# EAGLE design hgc (EAGLE 9.5.2)
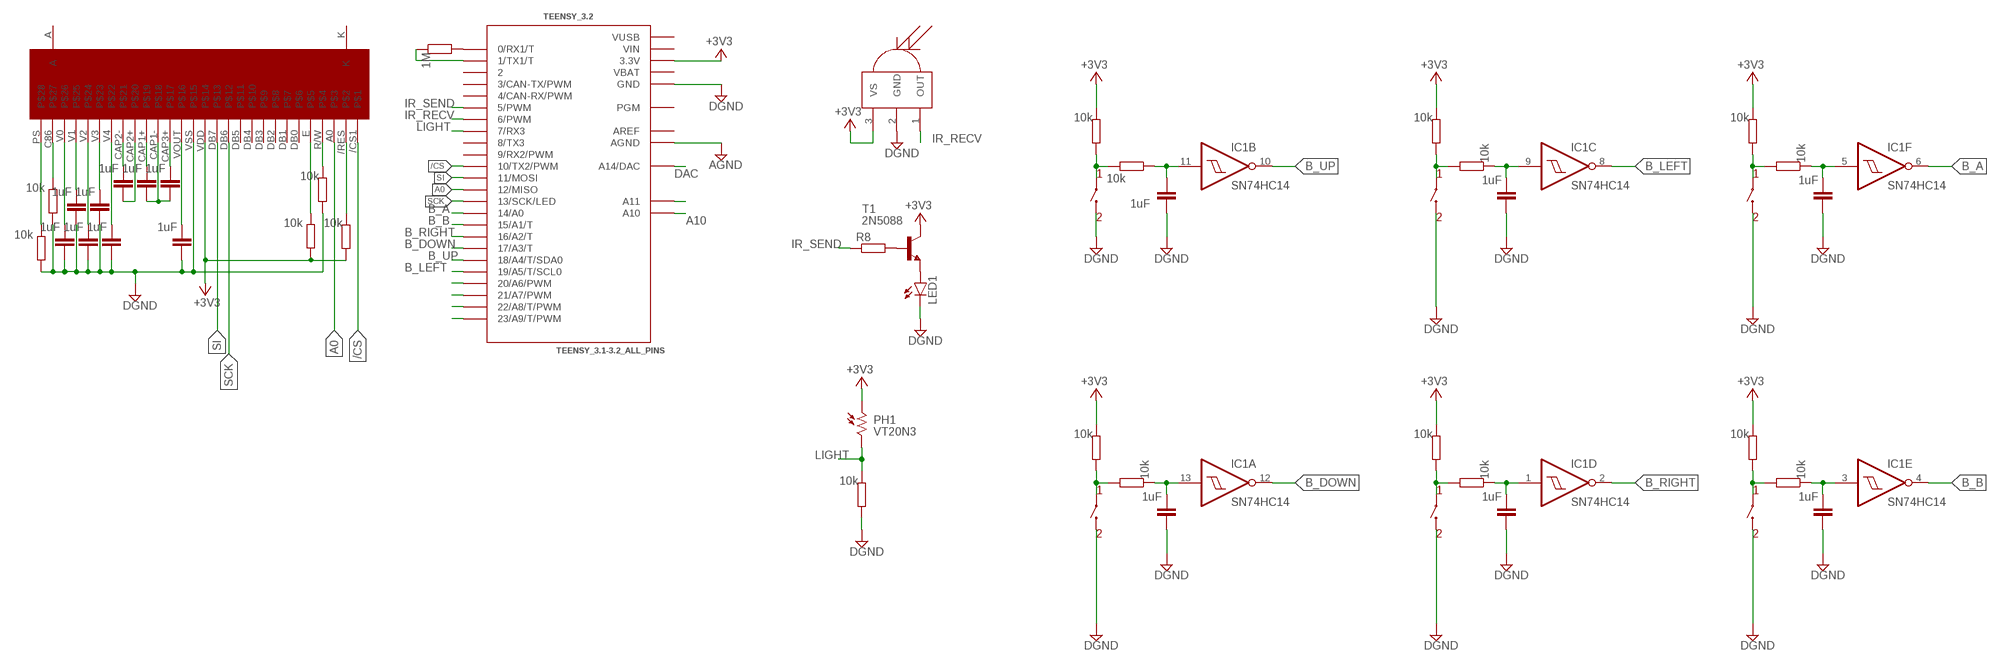
[diagram p0: schematic, sheet 1]

## Parts
A  TACTILE_SWITCH  [SPST-NO]
B  TACTILE_SWITCH  [SPST-NO]
C1  1uF  C-EUC0603  [C0603]
C2  1uF  C-EUC0603  [C0603]
C3  1uF  C-EUC0603  [C0603]
C4  1uF  C-EUC0603  [C0603]
C5  1uF  C-EUC0603  [C0603]
C6  1uF  C-EUC0603  [C0603]
C7  1uF  C-EUC0603  [C0603]
C8  1uF  C-EUC0603  [C0603]
C9  1uF  C-EUC0603  [C0603]
C10  1uF  C-EUC0603  [C0603]
C11  1uF  C-EUC0603  [C0603]
C12  1uF  C-EUC0603  [C0603]
C13  1uF  C-EUC0603  [C0603]
C14  1uF  C-EUC0603  [C0603]
C15  1uF  C-EUC0603  [C0603]
DOWN  TACTILE_SWITCH  [SPST-NO]
IC1  SN74HC14  74AC14D  [SO14]
LED1  LED3MM  [LED3MM]
LEFT  TACTILE_SWITCH  [SPST-NO]
PH1  VT20N3  [TO46-VT200]
R1  10k  R-EU_R0603  [R0603]
R2  10k  R-EU_R0603  [R0603]
R3  10k  R-EU_R0603  [R0603]
R4  10k  R-EU_R0603  [R0603]
R5  10k  R-EU_R0603  [R0603]
R6  10k  R-EU_R0603  [R0603]
R7  10k  R-EU_R0603  [R0603]
R8  R-EU_0204/7  [0204/7]
R9  10k  R-EU_R0603  [R0603]
R10  10k  R-EU_R0603  [R0603]
R11  10k  R-EU_R0603  [R0603]
R12  10k  R-EU_R0603  [R0603]
R13  10k  R-EU_R0603  [R0603]
R14  1M  R-EU_R0603  [R0603]
R15  10k  R-EU_R0603  [R0603]
R16  10k  R-EU_R0603  [R0603]
R18  10k  R-EU_R0603  [R0603]
R19  10k  R-EU_R0603  [R0603]
R21  10k  R-EU_R0603  [R0603]
R22  10k  R-EU_R0603  [R0603]
RIGHT  TACTILE_SWITCH  [SPST-NO]
T1  2N5088  [TO92]
TEENSY_3.2  TEENSY_3.1-3.2_ALL_PINS  [TEENSY_3.0-3.2&LC_ALL_PINS]
U$2  LCD_DISPLAY  [LCD_SCREEN]
U$3  IR_RECEIVER  [T-30_V]
UP  TACTILE_SWITCH  [SPST-NO]

## Nets
20: TEENSY_3.2.20/A6(20/A6/PWM)
21: TEENSY_3.2.21/A7(21/A7/PWM)
22: TEENSY_3.2.22/A8(22/A8/T/PWM)
23: TEENSY_3.2.23/A9(23/A9/T/PWM)
/CS: TEENSY_3.2.10(10/TX2/PWM) U$2./CS1
/WRITE: R2.1 U$2.R/W
A0: TEENSY_3.2.12(12/MISO) U$2.A0
A10: TEENSY_3.2.A10
A11: TEENSY_3.2.A11
AGND: TEENSY_3.2.AGND
B_A: IC1.6(F:O) TEENSY_3.2.14/A0
B_B: IC1.4(E:O) TEENSY_3.2.15/A1(15/A1/T)
B_DOWN: IC1.12(A:O) TEENSY_3.2.17/A3(17/A3/T)
B_LEFT: IC1.8(C:O) TEENSY_3.2.19/A5(19/A5/T/SCL0)
B_RIGHT: IC1.2(D:O) TEENSY_3.2.16/A2(16/A2/T)
B_UP: IC1.10(B:O) TEENSY_3.2.18/A4(18/A4/T/SDA0)
DAC: TEENSY_3.2.RESET/DAC(A14/DAC)
DGND: A.3 A.4 B.3 B.4 C1.2 C2.2 C3.2 C4.2 C5.2 C9.2 C10.2 C11.2 C12.2 C13.2 C14.2 C15.2 DOWN.3 DOWN.4 LED1.K(C) LEFT.3 LEFT.4 R2.2 R4.1 R5.1 R11.2 RIGHT.3 RIGHT.4 TEENSY_3.2.GND TEENSY_3.2.GND1(GND) U$2.VSS U$3.2(GND) UP.3 UP.4
ENABLE: R1.2 U$2.E
IR_RECV: TEENSY_3.2.6(6/PWM) U$3.1(OUT)
IR_SEND: R8.1 TEENSY_3.2.5(5/PWM)
LIGHT: PH1.2 R11.1 TEENSY_3.2.7(7/RX3)
N$1: C1.1 U$2.V0
N$2: C2.1 U$2.V1
N$3: C3.1 U$2.V2
N$4: C4.1 U$2.V3
N$5: C5.1 U$2.V4
N$6: C6.1 U$2.CAP2-
N$7: C7.1 U$2.CAP1+
N$8: C8.1 U$2.CAP3+
N$9: C9.1 U$2.VOUT
N$10: R3.1 U$2./RES
N$11: C6.2 U$2.CAP2+
N$12: C7.2 C8.2 U$2.CAP1-
N$13: R4.2 U$2.PS
N$14: R5.2 U$2.C86
N$15: LED1.A T1.3(E)
N$16: R6.2 R7.2 UP.1 UP.2
N$17: C10.1 IC1.11(B:I) R7.1
N$18: LEFT.1 LEFT.2 R9.2 R10.2
N$19: R8.2 T1.2(B)
N$20: C11.1 IC1.9(C:I) R10.1
N$21: A.1 A.2 R12.2 R13.2
N$23: C12.1 IC1.5(F:I) R13.1
N$24: DOWN.1 DOWN.2 R15.2 R16.2
N$25: R14.2 TEENSY_3.2.0(0/RX1/T)
N$26: C13.1 IC1.13(A:I) R16.1
N$27: R18.2 R19.2 RIGHT.1 RIGHT.2
N$28: R14.1 TEENSY_3.2.1(1/TX1/T)
N$29: C14.1 IC1.1(D:I) R19.1
N$30: B.1 B.2 R21.2 R22.2
N$32: C15.1 IC1.3(E:I) R22.1
SCK: TEENSY_3.2.13(13/SCK/LED) U$2.DB6
SI: TEENSY_3.2.11(11/MOSI) U$2.DB7
VCC: PH1.1 R1.1 R3.2 R6.1 R9.1 R12.1 R15.1 R18.1 R21.1 T1.1(C) TEENSY_3.2.3.3V TEENSY_3.2.3.3V1(3.3V) U$2.VDD U$3.3(VS) ; supply symbol labelled +3V3
Unconnected: TEENSY_3.2.2 TEENSY_3.2.3(3/CAN-TX/PWM) TEENSY_3.2.4(4/CAN-RX/PWM) TEENSY_3.2.8(8/TX3) TEENSY_3.2.9(9/RX2/PWM) TEENSY_3.2.PGM U$2.DB0 U$2.DB1 U$2.DB2 U$2.DB3 U$2.DB4 U$2.DB5

## Power pins joined to a net without a drawn wire
A: U$2.A
AREF: TEENSY_3.2.AREF
DGND: IC1.7(P:GND)
K: U$2.K
VBAT: TEENSY_3.2.VBAT
VCC: IC1.14(P:VCC)
VIN: TEENSY_3.2.VIN
VUSB: TEENSY_3.2.VUSB

## Library data of the parts
A B DOWN LEFT RIGHT UP = game_parts_library:TACTILE_SWITCH: A single pole single throw, normally open tactile switch. Manufacturer: C&K <https://www.ckswitches.com/> Manufacturer Part #: PTS526 SM15 SMTR2 LFS <https://dznh3ojzb2azq.cloudfront.net/products/Tactile/PTS526/documents/datasheet.pdf> Supplier: Digikey <https://www.digikey.com.au/> Supplier Part #: CKN12220-1-ND <https://www.digikey.com.au/short/zc3vrv>
C1-C15 = rcl:C-EU: CAPACITOR, European symbol; SPICEPREFIX: C
IC1 = 74xx-eu:74*14: Hex schmitt trigger INVERTER
LED1 = led:LED: LED OSRAM: - CHIPLED LG R971, LG N971, LY N971, LG Q971, LY Q971, LO R971, LY R971 LH N974, LH R974 LS Q976, LO Q976, LY Q976 LO Q996 - Hyper CHIPLED LW Q18S LB Q993, LB Q99A, LB R99A - SideLED LS A670, LO A670, LY A670, LG A670, LP A670 LB A673, LV A673, LT A673, LW A673 LH A674 LY A675 LS A676, LA A676, LO A676, LY A676, LW A676 LS A679, LY A679, LG A679 - Hyper Micro SIDELED® LS Y876, LA Y876, LO Y876, LY Y876 LT Y87S - SmartLED LW L88C, LW L88S LB L89C, LB L89S, LG L890 LS L89K, LO L89K, LY L89K LS L896, LA L896, LO L896, LY L896 - TOPLED LS T670, LO T670, LY T670, LG T670, LP T670 LSG T670, LSP T670, LSY T670, LOP T670, LYG T670 LG T671, LOG T671, LSG T671 LB T673, LV T673, LT T673, LW T673 LH T674 LS T676, LA T676, LO T676, LY T676, LB T676, LH T676, LSB T676, LW T676 LB T67C, LV T67C, LT T67C, LS T67K, LO T67K, LY T67K, LW E67C LS E67B, LA E67B, LO E67B, LY E67B, LB E67C, LV E67C, LT E67C LW T67C LS T679, LY T679, LG T679 LS T770, LO T770, LY T770, LG T770, LP T770 LB T773, LV T773, LT T773, LW T773 LH T774 LS E675, LA E675, LY E675, LS T675 LS T776, LA T776, LO T776, LY T776, LB T776 LHGB T686 LT T68C, LB T68C - Hyper Mini TOPLED® LB M676 - Mini TOPLED Santana® LG M470 LS M47K, LO M47K, LY M47K Source: http://www.osram.convergy.de LUXEON: - LUMILED® LXK2-PW12-R00, LXK2-PW12-S00, LXK2-PW14-U00, LXK2-PW14-V00 LXK2-PM12-R00, LXK2-PM12-S00, LXK2-PM14-U00 LXK2-PE12-Q00, LXK2-PE12-R00, LXK2-PE12-S00, LXK2-PE14-T00, LXK2-PE14-U00 LXK2-PB12-K00, LXK2-PB12-L00, LXK2-PB12-M00, LXK2-PB14-N00, LXK2-PB14-P00, LXK2-PB14-Q00 LXK2-PR12-L00, LXK2-PR12-M00, LXK2-PR14-Q00, LXK2-PR14-R00 LXK2-PD12-Q00, LXK2-PD12-R00, LXK2-PD12-S00 LXK2-PH12-R00, LXK2-PH12-S00 LXK2-PL12-P00, LXK2-PL12-Q00, LXK2-PL12-R00 Source: www.luxeon.com KINGBRIGHT: KA-3528ASYC Source: www.kingbright.com
PH1 = photo-elements:VT2*: Photoconductive Cell VT200 Series Source: http://optoelectronics.perkinelmer.com/content/Datasheets/DTS_vt200seriesdatasheet.pdf
R1-R16 R18 R19 R21 R22 = rcl:R-EU_: RESISTOR, European symbol; SPICEPREFIX: R
T1 = transistor:2N5088: NPN TRANSISTOR
TEENSY_3.2 = Teensy_3_and_LC_Series_Boards_v1.4:TEENSY_3.1-3.2_ALL_PINS: Footprint for Teensy 3.1 or 3.2 board using all through-holes, i.e. the entire perimeter plus the 4 through-holes inboard (A10,A11,AREF, VUSB)
U$2 = game_parts_library:LCD_DISPLAY
U$3 = game_parts_library:IR_RECEIVER

## Board
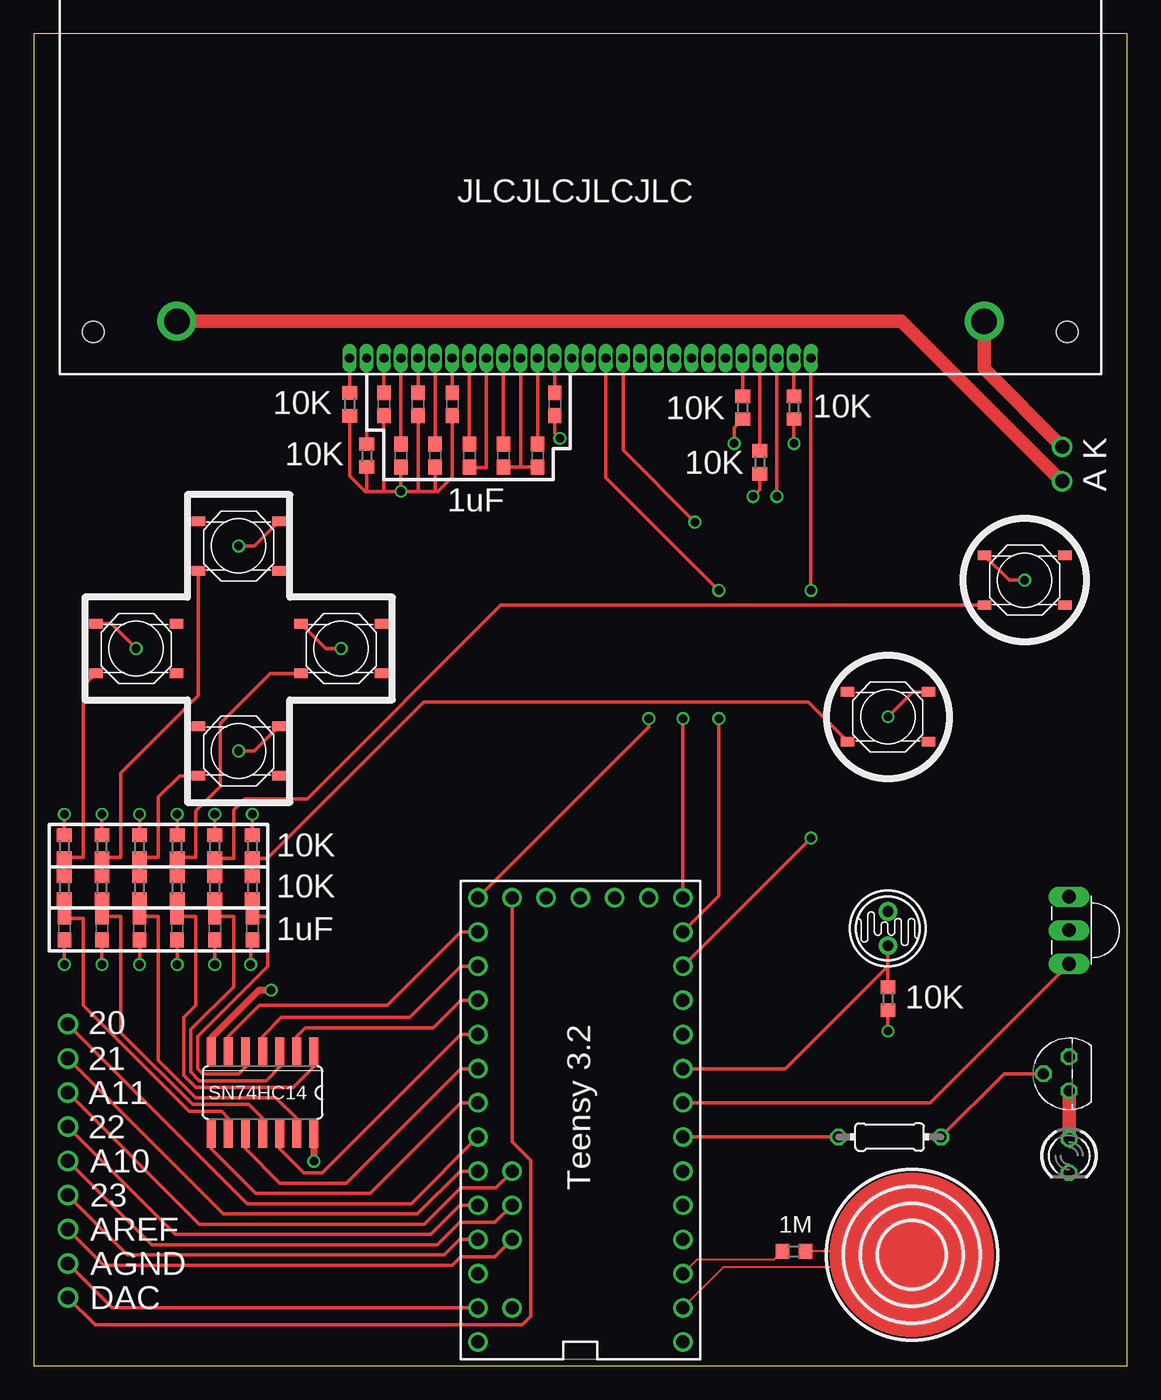
[diagram p1: board, top side]
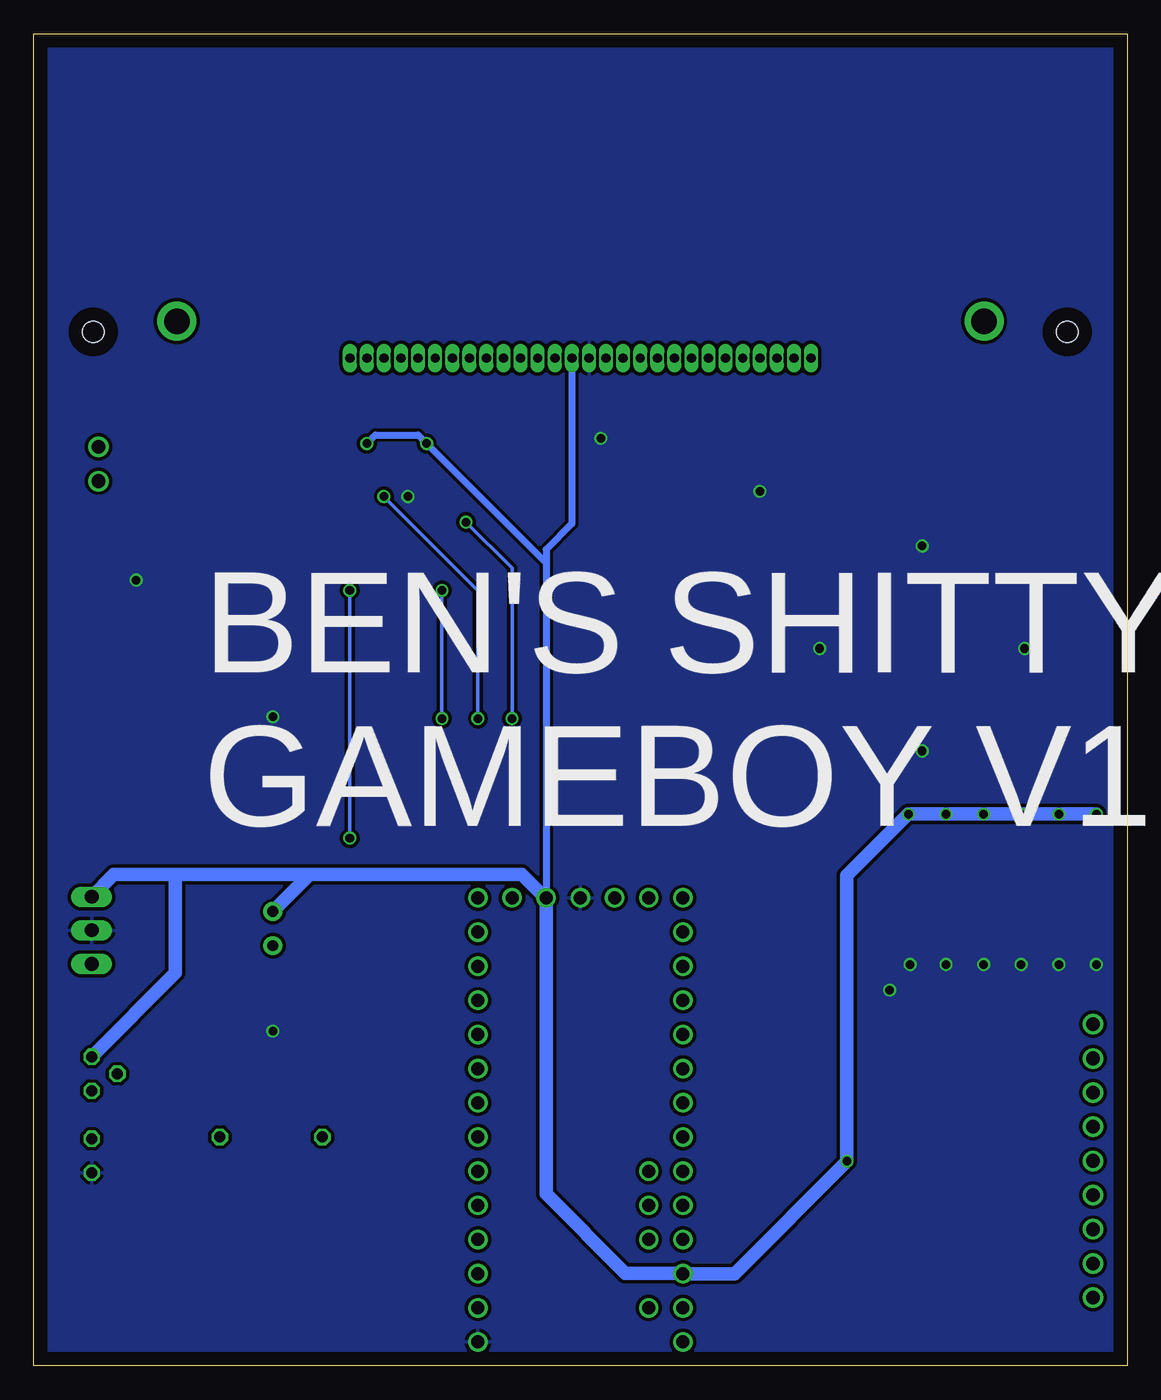
[diagram p2: board, bottom side, seen from below]

Size 81.28 x 99.06 mm. Coordinates in mm from the lower left corner, seen from the top.
Outline: 0,0 81.28,0 81.28,99.06 0,99.06 0,0
Copper layers (1*16): Top 0.035mm / dielectric 1.5mm / Bottom 0.035mm
Design rules "default *": minimum track width 6mil, minimum drill 0.35mm, track to track 10mil, track to pad 10mil, pad to pad 6mil, via to via 6mil, smd to smd 6mil, copper to edge 40mil, drill to drill 6mil, minimum pad ring 0mil, minimum via ring 0mil, stop-mask expansion 4mil, vias tented up to drill 0mil, thermal gap 10mil

### Footprints (pad centres in the part's own frame; a part is rotated, then mirrored left to right if it is on the bottom)
SPST-NO = smd 1 x 0.7: 1 -3,1.85; 2 3,1.85; 3 -3,-1.85; 4 3,-1.85
C0603 = smd 1.1 x 1: 1 -0.85,0; 2 0.85,0
SO14 = smd 0.66 x 2.032: 1 -3.81,-3.073; 2 -2.54,-3.073; 3 -1.27,-3.073; 4 0,-3.073; 5 1.27,-3.073; 6 2.54,-3.073; 7 3.81,-3.073; 8 3.81,3.073; 9 2.54,3.073; 10 1.27,3.073; 11 0,3.073; 12 -1.27,3.073; 13 -2.54,3.073; 14 -3.81,3.073
LED3MM = drill 0.813 octagon: A -1.27,0; K 1.27,0
TO46-VT200 = drill 0.8 pad 1.4: 1 -1.27,0; 2 1.27,0
R0603 = smd 1 x 1.1: 1 -0.85,0; 2 0.85,0
0204/7 = drill 0.813 octagon: 1 -3.81,0; 2 3.81,0
TO92 = drill 0.813 octagon: 1 1.27,0; 2 0,1.905; 3 -1.27,0
TEENSY_3.0-3.2&LC_ALL_PINS = drill 0.965: 0 -7.62,13.97; 1 -7.62,11.43; 2 -7.62,8.89; 3 -7.62,6.35; 3.3V 7.62,11.43; 3.3V1 -2.54,-16.51; 4 -7.62,3.81; 5 -7.62,1.27; 6 -7.62,-1.27; 7 -7.62,-3.81; 8 -7.62,-6.35; 9 -7.62,-8.89; 10 -7.62,-11.43; 11 -7.62,-13.97; 12 -7.62,-16.51; 13 7.62,-16.51; 14/A0 7.62,-13.97; 15/A1 7.62,-11.43; 16/A2 7.62,-8.89; 17/A3 7.62,-6.35; 18/A4 7.62,-3.81; 19/A5 7.62,-1.27; 20/A6 7.62,1.27; 21/A7 7.62,3.81; 22/A8 7.62,6.35; 23/A9 7.62,8.89; A10 5.08,6.35; A11 5.08,3.81; AGND 7.62,13.97; AREF 5.08,8.89; GND -7.62,16.51; GND1 0,-16.51; PGM 2.54,-16.51; RESET/DAC 5.08,-16.51; VBAT -5.08,-16.51; VIN 7.62,16.51; VUSB 5.08,13.97
LCD_SCREEN = drill 0.7 pad 0.94 long: /CS1 17.14,0; /RES 15.87,0; A0 14.6,0; C86 -15.88,0; CAP1+ -5.72,0; CAP1- -4.45,0; CAP2+ -6.99,0; CAP2- -8.26,0; CAP3+ -3.18,0; DB0 10.79,0; DB1 9.52,0; DB2 8.25,0; DB3 6.98,0; DB4 5.71,0; DB5 4.44,0; DB6 3.17,0; DB7 1.9,0; E 12.06,0; PS -17.15,0; R/W 13.33,0; V0 -14.61,0; V1 -13.34,0; V2 -12.07,0; V3 -10.8,0; V4 -9.53,0; VDD 0.63,0; VOUT -1.91,0; VSS -0.64,0 | drill 1.9 pad 2.9: A -30,2.74; K 30,2.74 | hole 1.6: -36.2,1.95; 36.2,1.95
T-30_V = drill 1.016 long: 1 2.5,0; 2 0,0; 3 -2.5,0

### Placement (x,y rotation side)
A  63.5,48.26 180 top
B  73.66,58.42 180 top
C1  26.04,71.5 270 top
C2  27.3,67.69 270 top
C3  28.57,71.5 270 top
C4  29.84,67.69 270 top
C5  31.11,71.5 270 top
C6  32.38,67.69 270 top
C7  34.92,67.69 270 top
C8  37.47,67.69 270 top
C9  38.73,71.5 270 top
C10  5.08,32.51 270 top
C11  2.29,32.51 270 top
C12  16.26,32.51 270 top
C13  7.87,32.51 270 top
C14  10.67,32.51 270 top
C15  13.46,32.51 270 top
DOWN  15.24,45.72 180 top
IC1  17.02,20.32 180 top
LED1  76.96,15.62 270 top
LEFT  7.62,53.34 180 top
PH1  63.5,32.51 270 top
R1  52.7,71.25 90 top
R2  53.98,67.18 270 top
R3  56.52,71.25 270 top
R4  23.5,71.5 90 top
R5  24.77,67.69 90 top
R6  5.08,38.61 270 top
R7  5.08,35.56 90 top
R8  63.63,17.02 0 top
R9  2.29,38.61 270 top
R10  2.29,35.56 90 top
R11  63.5,27.3 270 top
R12  16.26,38.61 270 top
R13  16.26,35.56 90 top
R14  56.52,8.51 0 top
R15  7.87,38.61 270 top
R16  7.87,35.56 90 top
R18  10.67,38.61 270 top
R19  10.67,35.56 90 top
R21  13.46,38.61 270 top
R22  13.46,35.56 90 top
RIGHT  22.86,53.34 180 top
T1  76.96,21.72 90 top
TEENSY_3.2  40.64,18.29 180 top
U$2  40.64,74.93 0 top
U$3  76.96,32.38 270 top
UP  15.24,60.96 180 top

### Tracks (layer width: path | path; a pad name or v marks a point on that pad's centre or on a via)
20  (via drill 1.02)
  Top 0.254: TEENSY_3.2.20/A6 28.07,12.06 15.88,12.06 v2.54,25.4
21  (via drill 1.02)
  Top 0.254: TEENSY_3.2.21/A7 31.71,14.48 28.53,11.3 14.1,11.3 v2.54,22.86
22  (via drill 1.02)
  Top 0.254: TEENSY_3.2.22/A8 31.66,11.94 29.5,9.78 10.54,9.78 v2.54,17.78
23  (via drill 1.02)
  Top 0.254: TEENSY_3.2.23/A9 31.66,9.4 30.52,8.26 6.96,8.26 2.54,12.68 v2.54,12.7
/CS  (via drill 0.64)
  Top 0.254: U$2./CS1 v57.78,57.66 | v57.78,39.24 TEENSY_3.2.10
  Bottom 0.254: v57.78,57.66 v57.78,39.24
/WRITE
  Top 0.254: U$2.R/W R2.1
A  (via drill 1.02)
  Top 1.016: v76.45,65.79 76.37,65.79 64.49,77.67 U$2.A
A0  (via drill 0.64)
  Top 0.254: TEENSY_3.2.12 v48.26,48.13 | v55.24,64.64 U$2.A0
  Bottom 0.254: v48.26,48.13 48.26,57.66 v55.24,64.64
A10  (via drill 1.02)
  Top 0.254: v2.54,15.24 8.76,9.02 30.01,9.02 31.66,10.67 34.29,10.67 TEENSY_3.2.A10
A11  (via drill 1.02)
  Top 0.254: TEENSY_3.2.A11 35.56,14.44 34.37,13.25 31.75,13.25 29.04,10.54 12.32,10.54 v2.54,20.32
AGND  (via drill 1.02)
  Top 0.254: TEENSY_3.2.AGND 5.84,4.32 v2.54,7.62
AREF  (via drill 1.02)
  Top 0.254: TEENSY_3.2.AREF 34.29,8.13 31.75,8.13 31.11,7.49 5.21,7.49 v2.54,10.16
B_A
  Top 0.254: IC1.6 14.48,24.51 16.76,26.8 26.29,26.8 31.75,32.26 TEENSY_3.2.14/A0
B_B
  Top 0.254: TEENSY_3.2.15/A1 31.75,29.72 27.94,25.91 18.41,25.91 17.02,24.51 IC1.4
B_DOWN
  Top 0.254: TEENSY_3.2.17/A3 31.75,24.64 21.46,14.35 20.07,14.35 18.29,16.13 IC1.12
B_LEFT
  Top 0.254: IC1.8 13.21,16.13 16.51,12.83 25.02,12.83 31.75,19.56 TEENSY_3.2.19/A5
B_RIGHT
  Top 0.254: IC1.2 19.56,24.51 20.19,25.15 29.72,25.15 31.75,27.18 TEENSY_3.2.16/A2
B_UP
  Top 0.254: IC1.10 15.75,16.13 18.29,13.59 23.24,13.59 31.75,22.1 TEENSY_3.2.18/A4
DAC  (via drill 1.02)
  Top 0.254: v2.54,5.08 4.57,3.05 36.32,3.05 36.96,3.68 36.96,15.28 35.56,16.68 TEENSY_3.2.RESET/DAC
DGND  (via drill 0.64)
  Top 0.254: R4.1 23.5,66.17 24.64,65.02 24.77,65.02 | 24.77,65.02 26.04,65.02 | 26.04,65.02 v27.3,65.02 | v27.3,65.02 28.57,65.02 | 28.57,65.02 29.84,65.02 | 29.84,65.02 30.05,65.02 31.11,66.08 C5.2 | C1.2 26.04,65.02 | C3.2 28.57,65.02 | C4.2 29.84,65.02 | R5.1 24.77,65.02 | C2.2 v27.3,65.02 | C9.2 38.73,69.34 v39.12,68.96 | R2.2 53.98,65.15 v53.47,64.64 | v7.62,53.34 5.77,55.19 LEFT.4 | C11.2 v2.29,29.84 | C10.2 v5.08,29.84 | C13.2 v7.87,29.84 | C14.2 v10.67,29.84 | C15.2 v13.46,29.84 | C12.2 16.13,31.54 v16.13,29.84 | RIGHT.4 21.71,53.34 v22.86,53.34 | UP.3 16.39,60.96 v15.24,60.96 | v73.66,58.42 72.51,58.42 B.4 | A.3 65.35,50.11 v63.5,48.26 | R11.2 v63.5,24.89 | DOWN.3 16.39,45.72 v15.24,45.72
  Top 0.508: IC1.7 13.21,24.38 16.76,27.94 v17.65,27.94
  pour Bottom: -2.41,101.35 83.44,101.35 83.44,-3.17 83.19,-3.43 -0.64,-3.43 -2.41,-1.65
ENABLE
  Top 0.254: U$2.E R1.2
IR_RECV
  Top 0.254: U$3.1 66.64,19.56 TEENSY_3.2.6
IR_SEND
  Top 0.254: R8.1 TEENSY_3.2.5
K  (via drill 1.02)
  Top 1.016: U$2.K 70.64,74.14 v76.45,68.33
LIGHT
  Top 0.254: PH1.2 63.5,29.72 | 63.5,29.72 R11.1 | 63.5,29.72 55.88,22.1 TEENSY_3.2.7
N$1
  Top 0.254: U$2.V0 C1.1
N$2
  Top 0.254: U$2.V1 C2.1
N$3
  Top 0.254: U$2.V2 C3.1
N$4
  Top 0.254: U$2.V3 C4.1
N$5
  Top 0.254: U$2.V4 C5.1
N$6
  Top 0.254: U$2.CAP2- C6.1
N$7
  Top 0.254: U$2.CAP1+ C7.1
N$8
  Top 0.254: U$2.CAP3+ C8.1
N$9
  Top 0.254: U$2.VOUT C9.1
N$10
  Top 0.254: U$2./RES R3.1
N$11
  Top 0.254: U$2.CAP2+ 33.65,66.81 33.66,66.8 32.42,66.8 C6.2
N$12
  Top 0.254: C7.2 36.2,66.84 | 36.2,66.84 C8.2 | U$2.CAP1- 36.19,66.85 36.2,66.84
N$13
  Top 0.254: U$2.PS R4.2
N$14
  Top 0.254: U$2.C86 R5.2
N$15
  Top 1.016: LED1.A T1.3
N$16
  Top 0.254: UP.2 12.24,49.83 6.48,44.07 6.48,37.81 5.14,37.81 R6.2 R7.2
N$17
  Top 0.254: C10.1 5.12,33.4 | 5.12,33.4 6.48,33.4 6.48,31.11 6.48,24.77 11.81,19.43 15.98,19.43 17.02,18.39 IC1.11 | R7.1 5.08,33.44 5.12,33.4
N$18
  Top 0.254: LEFT.2 3.68,50.55 3.68,37.81 2.34,37.81 R9.2 R10.2
N$19
  Top 0.254: R8.2 72.14,21.72 T1.2
N$20
  Top 0.254: IC1.9 14.48,18.41 13.97,18.92 11.56,18.92 3.68,26.8 3.68,31.08 3.68,33.27 2.33,33.27 2.33,33.4 | C11.1 2.33,33.4 | R10.1 2.33,34.67 2.33,33.4
N$21
  Top 0.254: A.2 57.56,49.35 29,49.35 17.36,37.72 16.3,37.72 R12.2 R13.2
N$23
  Top 0.254: C12.1 16.3,33.4 | 16.3,33.4 17.4,33.4 17.4,29.72 12.19,24.51 12.19,22.1 12.57,21.72 15.24,21.72 15.75,22.23 IC1.5 | R13.1 16.3,34.67 16.3,33.4
N$24
  Top 0.254: DOWN.2 10.85,43.87 9.27,42.29 9.27,37.81 7.93,37.81 R15.2 R16.2
N$25
  Top 0.152: TEENSY_3.2.0 51.31,7.37 59.31,7.37 | R14.2 58.67,8.51 59.18,8.51 59.31,8.38 59.31,7.37 | 59.31,7.37 59.44,7.37
N$26
  Top 0.254: C13.1 7.91,33.4 | 7.91,33.4 9.27,33.4 9.27,22.73 12.06,19.94 18.01,19.94 19.56,18.39 IC1.13 | R16.1 7.87,33.44 7.91,33.4
N$27
  Top 0.254: RIGHT.2 17.57,51.49 13.86,47.77 13.86,43.07 12.06,41.27 12.06,37.81 10.72,37.81 R18.2 R19.2
N$28
  Top 0.152: TEENSY_3.2.1 49.28,7.87 55.03,7.87 R14.1
N$29
  Top 0.254: 12.06,33.4 10.71,33.4 | 10.71,33.4 C14.1 | IC1.1 20.83,22.23 19.3,20.7 12.06,20.7 11.18,21.59 11.18,25.91 12.06,26.8 12.06,33.4 | 12.06,33.4 | R19.1 10.71,34.67 10.71,33.4
N$30
  Top 0.254: B.2 34.73,56.57 20.32,42.16 15.69,42.16 14.86,41.33 14.86,37.72 13.5,37.72 R21.2 R22.2
N$32
  Top 0.254: C15.1 13.5,33.4 | 13.5,33.4 14.86,33.4 14.86,28.19 11.68,25.02 11.68,21.84 12.32,21.21 17.27,21.21 18.29,22.23 IC1.3 | R22.1 13.5,34.67 13.5,33.4
SCK  (via drill 0.64)
  Top 0.254: TEENSY_3.2.13 45.72,47.5 v45.72,48.13 | v49.15,62.74 43.81,68.08 U$2.DB6
  Bottom 0.254: v45.72,48.13 45.72,59.31 v49.15,62.74
SI  (via drill 0.64)
  Top 0.254: U$2.DB7 42.54,66.05 v50.93,57.66 | v50.93,48.13 50.93,34.92 TEENSY_3.2.11
  Bottom 0.254: v50.93,57.66 v50.93,48.13
VCC  (via drill 0.64)
  Top 0.254: R1.1 52.07,69.76 v52.07,68.58 | v2.29,41.02 R9.1 | R6.1 v5.08,41.02 | R15.1 v7.87,41.02 | R18.1 v10.67,41.02 | R21.1 v13.46,41.02 | R12.1 v16.26,41.02 | R3.2 v56.52,68.58
  Top 0.508: IC1.14 v20.83,15.21
  Bottom 0.508: v56.52,68.58 55.88,69.22 52.7,69.22 v52.07,68.58 43.18,59.69 | 43.18,59.69 43.18,60.71 41.27,62.62 U$2.VDD | 43.18,59.69 TEENSY_3.2.3.3V1
  Bottom 1.016: 60.74,36.54 45,36.54 43.26,34.8 TEENSY_3.2.3.3V1 43.18,12.78 37.3,6.9 33.06,6.9 TEENSY_3.2.3.3V 29.18,6.86 v20.83,15.21 20.83,36.45 v16.26,41.02 v13.46,41.02 v10.67,41.02 v7.87,41.02 v5.08,41.02 v2.29,41.02 | 60.74,36.54 PH1.1 | U$3.3 75.31,36.54 70.74,36.54 | 70.74,36.54 60.74,36.54 | T1.1 70.74,29.21 70.74,36.54
(copper drawn outside any net)
  shapes: Top circle x1

### Text on the board
tPlace: JLCJLCJLCJLC | 10K | 10K | 10K | 10K | 10K | A K | 1uF | 10K | 10K | 1uF | 10K | 20 | 21 | A11 | 22 | A10 | Teensy 3.2 | 23 | AREF | AGND | DAC
bPlace: BEN'S SHITTY / GAMEBOY V1